# EAGLE design STDAP_V_1_0_0 (EAGLE 7.6.0)
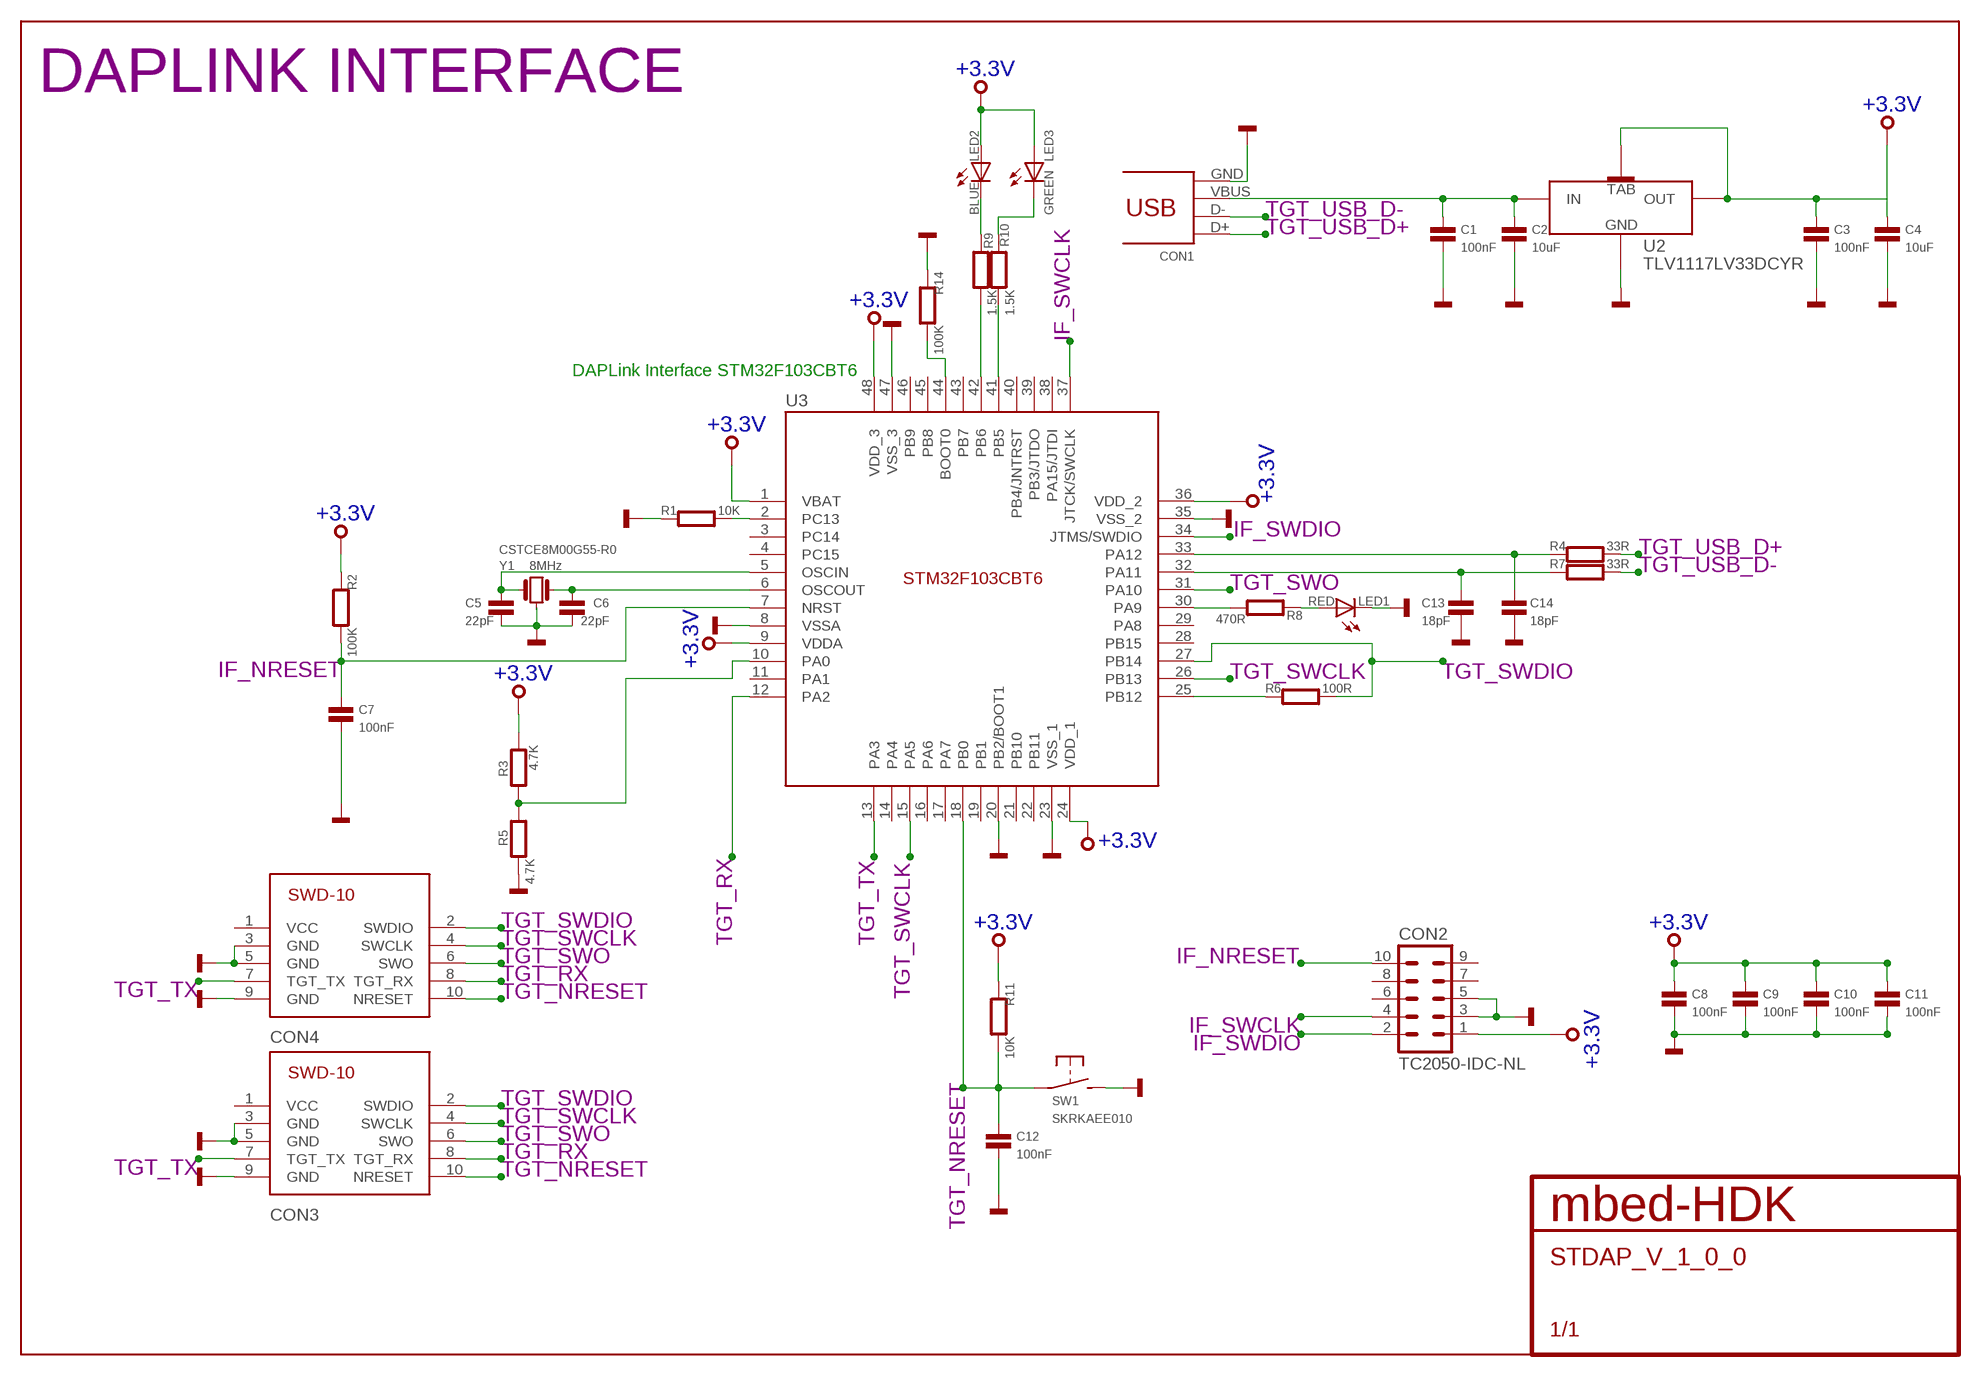
[diagram p0: schematic, sheet 1]

## Parts
C1  100nF  CAPACITOR0402  [0402]
C2  10uF  CAPACITOR0603  [0603]
C3  100nF  CAPACITOR0402  [0402]
C4  10uF  CAPACITOR0603  [0603]
C5  22pF  CAPACITOR0402  [0402]
C6  22pF  CAPACITOR0402  [0402]
C7  100nF  CAPACITOR0402  [0402]
C8  100nF  CAPACITOR0402  [0402]
C9  100nF  CAPACITOR0402  [0402]
C10  100nF  CAPACITOR0402  [0402]
C11  100nF  CAPACITOR0402  [0402]
C12  100nF  CAPACITOR0402  [0402]
C13  18pF  CAPACITOR0402  [0402]
C14  18pF  CAPACITOR0402  [0402]
CON1  47346-0001  [USB-MICRO-B-H]
CON2  TC2050-IDC-NL  [TC2050-IDC-NL]
CON3  3020-10-0200-00  [3020-10-0200-00]
CON4  3220-10-0200-00  [3220-10-0200-00]
LED1  RED  SMD_LED0603  [CHIPLED_0603]
LED2  BLUE  SMD_LED0603  [CHIPLED_0603]
LED3  GREEN  SMD_LED0603  [CHIPLED_0603]
R1  10K  RESISTOR0402  [0402]
R2  100K  RESISTOR0402  [0402]
R3  4.7K  RESISTOR0402  [0402]
R4  33R  RESISTOR0402  [0402]
R5  4.7K  RESISTOR0402  [0402]
R6  100R  RESISTOR0402  [0402]
R7  33R  RESISTOR0402  [0402]
R8  470R  RESISTOR0402  [0402]
R9  1.5K  RESISTOR0402  [0402]
R10  1.5K  RESISTOR0402  [0402]
R11  10K  RESISTOR0402  [0402]
R14  100K  RESISTOR0402  [0402]
SW1  SKRKAEE010  [SKRKAEE010]
U2  TLV1117LV33DCYR  [SOT223]
U3  STM32F103CBT6  [LQFP48]
Y1  CSTCE8M00G55-R0  [CSTCE8M00G55-R0]

## Nets
+3.3V: C3.1 C4.1 C8.1 C9.1 C10.1 C11.1 CON2.1 LED2.A LED3.A R2.1 R3.1 R11.1 U2.OUT(1)(OUT) U2.OUT(2)(TAB) U3.1(VBAT) U3.9(VDDA) U3.24(VDD_1) U3.36(VDD_2) U3.48(VDD_3)
GND: C1.2 C2.2 C3.2 C4.2 C5.2 C6.2 C7.2 C8.2 C9.2 C10.2 C11.2 C12.2 C13.2 C14.2 CON1.GND CON2.3 CON2.5 CON3.3(GND) CON3.5(GND) CON3.9(GND) CON4.3(GND) CON4.5(GND) CON4.9(GND) LED1.C R1.1 R5.2 R14.1 SW1.P$2(S) U2.GND U3.8(VSSA) U3.20(PB2/BOOT1) U3.23(VSS_1) U3.35(VSS_2) U3.47(VSS_3) Y1.2
IF_NRESET: C7.1 CON2.10 R2.2 U3.7(NRST)
IF_SWCLK: CON2.4 U3.37(JTCK/SWCLK)
IF_SWDIO: CON2.2 U3.34(JTMS/SWDIO)
N$1: C1.1 C2.1 CON1.VBUS U2.IN
N$2: R8.2 U3.30(PA9)
N$3: R14.2 U3.44(BOOT0)
N$4: R1.2 U3.2(PC13)
N$5: C6.1 U3.6(OSCOUT) Y1.3
N$6: C5.1 U3.5(OSCIN) Y1.1
N$8: R3.2 R5.1 U3.10(PA0)
N$9: R9.2 U3.42(PB6)
N$10: R10.2 U3.41(PB5)
N$11: LED1.A R8.1
N$12: R6.1 U3.25(PB12)
N$13: LED2.C R9.1
N$14: LED3.C R10.1
N$15: C14.1 R4.1 U3.33(PA12)
N$17: C13.1 R7.1 U3.32(PA11)
TGT_NRESET: C12.1 CON3.10(NRESET) CON4.10(NRESET) R11.2 SW1.P$1(P) U3.18(PB0)
TGT_RX: CON3.8(TGT_RX) CON4.8(TGT_RX) U3.12(PA2)
TGT_SWCLK: CON3.4(SWCLK) CON4.4(SWCLK) U3.15(PA5) U3.26(PB13)
TGT_SWDIO: CON3.2(SWDIO) CON4.2(SWDIO) R6.2 U3.27(PB14)
TGT_SWO: CON3.6(SWO) CON4.6(SWO) U3.31(PA10)
TGT_TX: CON3.7(TGT_TX) CON4.7(TGT_TX) U3.13(PA3)
TGT_USB_D+: CON1.D+ R4.2
TGT_USB_D-: CON1.D- R7.2
Unconnected: CON2.6 CON2.7 CON2.8 CON2.9 CON3.1(VCC) CON4.1(VCC) U3.3(PC14) U3.4(PC15) U3.11(PA1) U3.14(PA4) U3.16(PA6) U3.17(PA7) U3.19(PB1) U3.21(PB10) U3.22(PB11) U3.28(PB15) U3.29(PA8) U3.38(PA15/JTDI) U3.39(PB3/JTDO) U3.40(PB4/JNTRST) U3.43(PB7) U3.45(PB8) U3.46(PB9)

## Notes on the sheet
- DAPLINK INTERFACE
- DAPLink Interface STM32F103CBT6
- 8MHz

## Library data of the parts
C1 C3 C7-C12 = mbed-HDK-RLCQ:CAPACITOR: Capacitor
C2 C4-C6 C13 C14 = mbed-HDK-RLC:CAPACITOR: Capacitor
CON1 = mbed-HDK-Connector:47346-0001: USB Receptacle Horizontal Micro Type B; MF: MOLEX; MFN: 47346-0001; OC-MOUSER: 538-47346-0001; OC-NEWARK: 1568026
CON2 = mbed-HDK-Connector:TC2050-IDC: Tag-Connect In Circuit Programming & Debug Cable 10 Pin
CON3 = mbed-HDK-Connector:3020-10-0200-00: 10 Positions Header Connector 0.100" (2.54mm) Through Hole, Right Angle Gold; MF: CNC Tech; MFN: 3020-10-0200-00; OC-DIGIKEY: 1175-1615-ND
CON4 = mbed-HDK-Connector:3220-10-0200-00: 10 Positions Header Connector 0.050" (1.27mm) Through Hole, Right Angle Gold; MF: CNC Tech; MFN: 3220-10-0200-00; OC-DIGIKEY: 1175-1628-ND
LED1-LED3 = mbed-HDK-Optical:SMD_LED: LED SMD, Colour Red; MF: Wurth Electronics Inc; MFN: 150060RS75000; OC-DIGIKEY: 732-4978-1-ND; OC-MOUSER: 710-150060RS75000; OC-NEWARK: 2322071
R1 R4 R6 R7 = mbed-HDK-RLC:RESISTOR: Resistor
R2 R3 R5 R8-R11 R14 = mbed-HDK-RLCQ:RESISTOR: Resistor
SW1 = mbed-HDK-Switch:SKRKAEE010: MOMENTARY SWITCH PUSH VERTICAL (SPST); MF: ALPS; MFN: SKRKAEE010; OC-MOUSER: 688-SKRKAE
U2 = mbed-HDK-Power:TLV1117LV33DCYR: LDO Fixed Regulator 3.3v, 1A; MF: Texas Instruments; MFN: TLV1117LV33DCYR; OC-DIGIKEY: 296-28778-1-ND; OC-MOUSER: 595-TLV1117LV33DCYR; OC-NEWARK: 2323647
U3 = mbed-HDK-MF-ST:STM32F103CBT6: ARM® Cortex®-M3 STM32 F1 Microcontroller IC 32-Bit 72MHz 128KB (128K x 8) FLASH; MF: STMicroelectronics; MFN: STM32F103CBT6; OC-DIGIKEY: 497-6288-ND; OC-MOUSER: 511-STM32F103CBT6; OC-NEWARK: 11N8296
Y1 = mbed-HDK-Oscillator:CSTCE8M00G55-R0: Resonator Cermanic, Murata 8MHz 33pF; MF: Murata; MFN: CSTCE8M00G55-R0; OC-DIGIKEY: 490-1195-1-ND; OC-MOUSER: 81-CSTCE8M00G55-R0; OC-NEWARK: 2443270

## Board
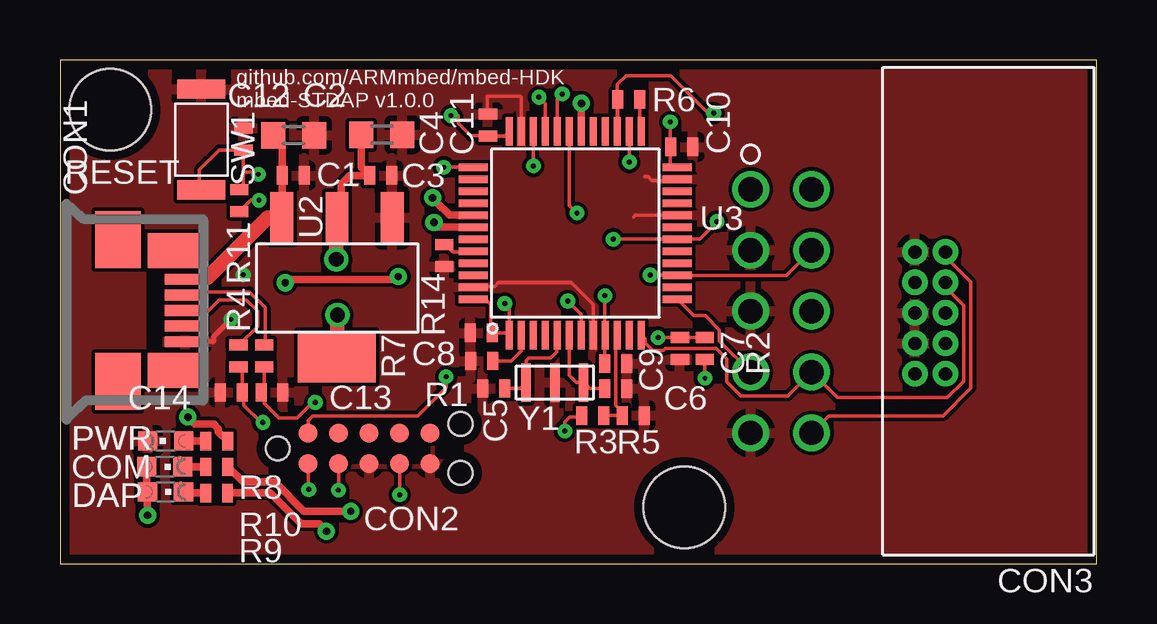
[diagram p1: board, top side]
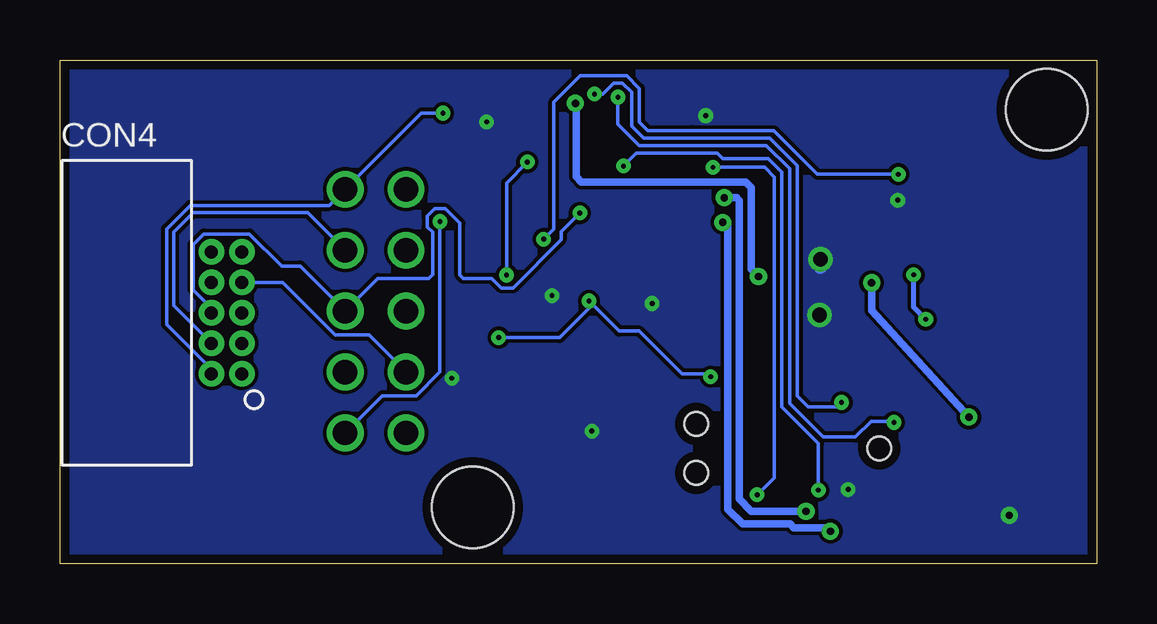
[diagram p2: board, bottom side, seen from below]

Size 43.2 x 21 mm. Coordinates in mm from the lower left corner, seen from the top.
Outline: 0,0 43.2,0 43.2,21 0,21 0,0
Copper layers ((1*16)): Top 0.035mm / dielectric 0.8mm / Bottom 0.035mm
Design rules "mbed-HDK-6-6-2-layer": minimum track width 6mil, minimum drill 9mil, track to track 6mil, track to pad 6mil, pad to pad 6mil, via to via 6mil, smd to smd 6mil, copper to edge 15mil, drill to drill 8mil, minimum pad ring 10mil, minimum via ring 8mil, stop-mask expansion 4mil, vias tented up to drill 0mil, thermal gap 10mil
Holes 3.4 mm at 26.01,2.34 2.1,18.92

### Footprints (pad centres in the part's own frame; a part is rotated, then mirrored left to right if it is on the bottom)
0402 = smd 0.457 x 0.762: 1 -0.457,0; 2 0.457,0
0603 = smd 1 x 1.1: 1 -0.85,0; 2 0.85,0
USB-MICRO-B-H = smd 1.7 x 0.45: 4 2.8,-0.65; D+ 2.8,0; D- 2.8,0.65; GND 2.8,-1.3; VBUS 2.8,1.3 | smd 1.9 x 2.375: GND1 0,2.95; GND4 0,-2.95 | smd 2.1 x 1.475: GND2 2.3,2.5; GND3 2.3,-2.5
TC2050-IDC-NL = smd 0.787 x 0.787: 1 -2.54,-0.635; 2 -1.27,-0.635; 3 0,-0.635; 4 1.27,-0.635; 5 2.54,-0.635; 6 2.54,0.635; 7 1.27,0.635; 8 0,0.635; 9 -1.27,0.635; 10 -2.54,0.635 | hole 0.991: -3.81,0; 3.81,1.016; 3.81,-1.016
3020-10-0200-00 = drill 1.02: 1 10.16,0; 2 10.16,-2.54; 3 7.62,0; 4 7.62,-2.54; 5 5.08,0; 6 5.08,-2.54; 7 2.54,0; 8 2.54,-2.54; 9 0,0; 10 0,-2.54
3220-10-0200-00 = drill 0.55 pad 0.9: 1 5.08,0; 2 5.08,-1.27; 3 3.81,0; 4 3.81,-1.27; 5 2.54,0; 6 2.54,-1.27; 7 1.27,0; 8 1.27,-1.27; 9 0,0; 10 0,-1.27
CHIPLED_0603 = smd 0.8 x 0.8: A 0,-0.75; C 0,0.75
SKRKAEE010 = smd 0.8 x 2: P$1 -2.1,0; P$2 2.1,0
SOT223 = smd 0.95 x 2.15: GND -2.3,-5.8; IN 2.3,-5.8; OUT(1) 0,-5.8 | smd 3.25 x 2.15: OUT(2) 0,0
LQFP48 = smd 0.3 x 1.2: 1 0,0; 2 0.5,0; 3 1,0; 4 1.5,0; 5 2,0; 6 2.5,0; 7 3,0; 8 3.5,0; 9 4,0; 10 4.5,0; 11 5,0; 12 5.5,0; 25 5.5,8.5; 26 5,8.5; 27 4.5,8.5; 28 4,8.5; 29 3.5,8.5; 30 3,8.5; 31 2.5,8.5; 32 2,8.5; 33 1.5,8.5; 34 1,8.5; 35 0.5,8.5; 36 0,8.5 | smd 1.2 x 0.3: 13 7,1.5; 14 7,2; 15 7,2.5; 16 7,3; 17 7,3.5; 18 7,4; 19 7,4.5; 20 7,5; 21 7,5.5; 22 7,6; 23 7,6.5; 24 7,7; 37 -1.5,7; 38 -1.5,6.5; 39 -1.5,6; 40 -1.5,5.5; 41 -1.5,5; 42 -1.5,4.5; 43 -1.5,4; 44 -1.5,3.5; 45 -1.5,3; 46 -1.5,2.5; 47 -1.5,2; 48 -1.5,1.5
CSTCE8M00G55-R0 = smd 0.4 x 1.6: 1 2.4,0; 2 1.2,0; 3 0,0

### Placement (x,y rotation side)
C1  9.72,16.19 0 top
C2  9.73,17.86 0 top
C3  13.37,16.19 0 top
C4  13.41,17.88 0 top
C5  18.07,7.3 180 top
C6  23.16,7.3 0 top
C7  25.83,8.97 270 top
C8  17.55,9.62 180 top
C9  23.16,8.34 0 top
C10  25.91,17.37 0 top
C11  17.83,18.29 90 top
C12  7.65,17.7 90 top
C13  8.83,7.14 0 top
C14  7.14,7.14 180 top
CON1  2.41,10.55 0 top
CON2  12.88,4.8 0 top
CON3  28.78,5.45 90 top
CON4  35.62,12.99 270 bottom
LED1  4.4,5.11 90 top
LED2  4.39,2.98 270 top
LED3  4.37,4.04 270 top
R1  17.57,8.45 0 top
R2  26.87,8.97 90 top
R3  22.2,6.17 0 top
R4  7.44,8.66 90 top
R5  23.88,6.17 0 top
R6  23.7,19.35 180 top
R7  8.51,8.66 90 top
R8  6.53,5.11 0 top
R9  6.52,2.94 0 top
R10  6.53,4.03 0 top
R11  7.47,15.14 90 top
R14  16.01,12.85 90 top
SW1  5.89,17.68 90 top
U2  11.54,8.62 180 top
U3  18.72,9.53 0 top
Y1  21.82,7.54 180 top

### Tracks (layer width: path | path; a pad name or v marks a point on that pad's centre or on a via)
+3.3V  (via drill 0.2, 0.3, 0.61)
  Top 0.152: U3.9 22.7,9.51 C9.1 v22.7,11.17 | R3.1 21.68,6.11 21.24,6.11 21.04,5.91 v21.04,5.52 | U3.24 25.49,16.52 25.43,16.59 25.43,17.35 | 25.43,17.35 C10.1 | 25.43,17.35 v25.43,18.41 | U3.36 18.54,17.83 C11.1 17.82,17.84 17.11,17.84 16.59,18.37 16.59,18.68 v16.29,18.68 | U3.48 17.73,11.03 17.96,10.79 17.96,9.67 C8.1 18.62,9.62 U3.1 18.72,10.65 v18.53,10.85 | CON2.1 10.34,3.11 v10.36,3.09 | R2.1 v26.87,7.73 | R11.1 7.94,15.15 v8.29,15.15
  Top 0.305: C4.1 12.56,16.54 C3.1 12.07,16.19 11.71,15.82 11.71,14.58 11.56,14.42 | LED3.A 3.62,3.01 LED2.A 3.64,2.11 v3.65,2.01
  Top 0.61: U2.OUT(2) 11.56,8.62 v11.56,10.36 | 11.56,14.42 U2.OUT(1) v11.51,12.68
  Bottom 0.152: v21.04,5.52 21.02,5.5 21.02,5.38 | v25.43,18.41 25.41,18.41 25.38,18.45 | v18.53,10.85 18.51,10.85 18.49,10.83 | v22.7,11.17 22.7,10.9 22.75,10.95 | v10.36,3.09 10.36,3.02 10.38,3 | v26.87,7.73 26.87,7.68 26.94,7.61 | v16.29,18.68 16.17,18.49 | v8.29,15.15 8.27,15.21 8.27,15.33
  Bottom 0.305: v3.65,2.01 3.65,1.87 3.63,1.86
  Bottom 0.61: 11.51,12.38 11.51,12.58 11.5,12.58
  pour Bottom: -2.82,-2.08 44.36,-1.92 44.65,22.36 -1.99,22.47
GND  (via drill 0.2)
  Top 0.152: U3.8 22.22,10.8 21.31,11.71 18.26,11.71 18.11,11.56 17.25,11.56 U3.47 | U3.20 23.97,14.53 23.9,14.45 | 24.36,16.13 24.51,16.13 24.66,15.98 25.67,15.98 U3.23 | U3.35 19.22,19.44 19.18,19.48 17.8,19.48 17.8,18.77 C11.2
  Top 0.203: v7.12,10.19 6.4,9.46 6.4,9.27 6.38,9.25 CON1.GND
  Bottom 0.203: v7.12,10.19 7.63,10.69 v7.63,12.04
  pour Top: -2.84,22.4 -2.62,-2.01 44.63,-1.74 44.4,22.67
IF_NRESET  (via drill 0.2)
  Top 0.152: U3.7 21.72,10.39 v21.16,10.95 | v24.92,9.42 C7.1 R2.2 | CON2.10 10.34,5.97 10.52,6.15 13.85,6.15 13.86,6.15 14.9,6.15 16.09,7.33 v16.09,7.79
  Bottom 0.152: v24.92,9.42 22.38,9.42 21.01,10.79 21.01,11.1 v21.16,10.95 19.91,9.7 19.06,9.7 17.27,7.92 16.21,7.92 v16.09,7.79
IF_SWCLK  (via drill 0.2)
  Top 0.152: U3.37 v15.99,16.52 | v14.15,2.87 CON2.4
  Bottom 0.152: v15.99,16.52 13.84,16.52 13.44,16.12 13.44,3.58 v14.15,2.87
IF_SWDIO  (via drill 0.2)
  Top 0.152: CON2.2 v11.61,3.07 v11.6,3.06 | v19.72,16.58 U3.34
  Bottom 0.152: v11.6,3.06 11.6,5.01 13.12,6.53 13.12,16.32 13.69,16.89 15.59,16.89 15.82,17.12 19.18,17.12 v19.72,16.58
N$1
  Top 0.203: 6.16,11.93 5.29,11.93 CON1.VBUS
  Top 0.305: U2.IN 9.26,14.42 C1.1 9.26,17.48 arc90 C2.1
  Top 0.61: 6.16,11.93 8.66,14.42 U2.IN
N$2  (via drill 0.3)
  Top 0.305: U3.30 v21.72,19.19 | v9.38,11.71 9.53,11.85 13.98,11.85 v14.1,11.97 | v5.33,6.11 5.62,5.82 6.4,5.82 6.6,5.61 6.6,5.49 R8.2
  Bottom 0.305: v21.72,19.19 21.7,19.16 21.7,16.13 21.48,15.91 14.64,15.91 14.4,15.68 14.4,12.28 v14.1,11.97 | v9.38,11.71 9.38,10.55 v5.33,6.11
N$3
  Top 0.152: R14.2 16.06,13.31 16.37,13 17.19,13 U3.44
N$4
  Top 0.152: R1.2 18.8,8.45 19.22,8.87 U3.2
N$5
  Top 0.152: U3.6 21.21,9.51 21.21,7.84 21.5,7.54 Y1.3 22.07,7.3 C6.1
N$6
  Top 0.152: U3.5 20.7,9.51 20.7,8.82 20.45,8.57 19.53,8.57 19.42,8.46 Y1.1 19.18,7.3 C5.1
N$8
  Top 0.152: U3.10 23.16,9.46 23.16,6.58 23.43,6.31 R5.1 R3.2
N$9  (via drill 0.3)
  Top 0.305: U3.42 15.78,14.03 v15.58,14.22 | 7,2.92 R9.2 8.76,2.94 10.05,1.65 | v11.1,1.35 10.79,1.65 10.05,1.65 | 10.05,1.65 10.03,1.65
  Bottom 0.305: v15.58,14.22 15.51,14.22 15.37,14.09 15.37,2.27 14.76,1.65 12.78,1.65 12.62,1.5 11.25,1.5 v11.1,1.35
N$10  (via drill 0.3)
  Top 0.305: U3.41 16.23,14.53 15.66,15.1 15.66,15.12 v15.53,15.25 | v12.12,2.18 v12.11,2.18 10.16,2.18 8.95,3.4 7.63,3.4 R10.2
  Bottom 0.305: v15.53,15.25 15.01,15.25 14.9,15.14 14.9,2.69 14.39,2.18 v12.12,2.18
N$11
  Top 0.305: LED1.A R8.1
N$12
  Top 0.152: U3.25 arc-90 24.16,18.09 R6.1
N$13
  Top 0.305: LED2.C 5.19,2.94 R9.1
N$14
  Top 0.305: LED3.C R10.1
N$15  (via drill 0.2)
  Top 0.152: R4.1 7.59,8.05 C14.1 7.66,7.07 7.66,6.6 8.38,5.89 v8.45,5.89 | U3.33 20.22,19.18 v19.95,19.45
  Bottom 0.152: v19.95,19.45 19.95,18.31 19.07,17.43 13.77,17.43 12.8,16.46 12.8,6.68 11.4,5.28 10.06,5.28 9.4,5.93 8.5,5.93 v8.45,5.89
N$17  (via drill 0.2)
  Top 0.152: U3.32 20.72,19.37 v20.93,19.58 | v10.64,6.72 10.49,6.68 9.88,6.07 9.12,6.07 8.51,6.68 8.51,7 C13.1 8.51,7.27 R7.1
  Bottom 0.152: v20.93,19.58 20.59,19.58 20.14,20.03 19.77,20.03 19.39,19.65 19.39,18.25 18.88,17.74 13.63,17.74 12.47,16.59 12.47,6.99 12.01,6.53 10.79,6.53 v10.64,6.72
TGT_NRESET  (via drill 0.2)
  Top 0.152: R11.2 7.64,15.77 7.64,16.32 | 7.64,16.32 C12.1 6.63,17.25 5.8,16.42 5.8,15.67 SW1.P$1 | v23.05,13.53 U3.18 26.66,13.53 26.66,13.54 27.38,14.26 v27.37,14.26 | v8.27,16.23 8.18,16.32 7.64,16.32 | CON4.10 36.89,12.79 37.96,11.73 37.96,7.32 36.79,6.16 32.03,6.16 CON3.10
  Bottom 0.152: v23.05,13.53 22.62,13.95 22.62,19.24 21.52,20.34 19.59,20.34 19.06,19.81 19.06,18.41 18.7,18.05 16.84,18.05 16.83,18.05 13.46,18.05 11.64,16.23 v8.27,16.23 | CON3.10 29.77,7 28.37,7 27.37,7.99 v27.37,14.26
TGT_RX
  Top 0.152: U3.12 24.39,9.35 24.39,9.2 24.7,8.89 25.14,8.89 25.22,8.97 27.34,8.97 27.79,8.52 27.79,7.58 28.37,7 30.32,7 CON3.8 32.38,6.92 36.97,6.92 37.65,7.6 37.65,10.77 36.89,11.52 CON4.8
TGT_SWCLK  (via drill 0.2)
  Top 0.152: v23.72,16.75 U3.26 | v24.59,12.03 24.61,12.01 24.66,12.01 24.67,12.03 U3.15 25.73,12.01 30.26,12.01 CON3.4
  Bottom 0.152: v24.59,12.03 24.59,15.88 v23.72,16.75 | CON4.4 36.89,9.21 38.46,10.77 38.46,13.83 37.66,14.63 32.88,14.63 CON3.4
TGT_SWDIO  (via drill 0.2)
  Top 0.152: R6.2 23.24,18.05 arc-90 U3.27 23.22,19.98 23.58,20.34 25.44,20.34 26.96,18.82 27.2,18.82 v27.24,18.78
  Bottom 0.152: v27.24,18.78 28.14,18.78 31.27,15.66 | 31.27,15.66 CON3.2 | CON4.2 36.89,8.11 38.76,9.98 38.76,13.96 37.78,14.94 31.99,14.94 31.27,15.66
TGT_SWO  (via drill 0.2)
  Top 0.152: U3.31 21.22,14.94 v21.54,14.62
  Bottom 0.152: v21.54,14.62 22.32,13.84 22.32,13.5 24.32,11.5 24.81,11.5 25.2,11.89 26.4,11.89 26.54,12.03 26.54,14.19 27.15,14.8 27.59,14.8 27.9,14.48 27.9,14.04 27.67,13.81 27.67,12.05 27.84,11.89 29.96,11.89 CON3.6 33.2,12.41 33.97,12.41 35.31,13.75 37.21,13.75 37.65,13.31 37.65,11.41 36.89,10.65 CON4.6
TGT_TX
  Top 0.152: U3.13 26.41,10.34 26.89,10.34 27.48,9.75 27.48,9.29 CON3.7
  Bottom 0.152: CON3.7 30.32,9.54 31.73,9.54 33.92,11.72 CON4.7
TGT_USB_D+
  Top 0.152: R4.2 7.46,9.12 8.23,9.89 8.23,10.53 7.76,11 6.63,11 6.17,10.54 5.22,10.54 CON1.D+
TGT_USB_D-
  Top 0.152: CON1.D- 5.21,11.33 7.89,11.33 8.55,10.67 8.55,9.16 R7.2

### Text on the board
tPlace: github.com/ARMmbed/mbed-HDK / mbed-STDAP v1.0.0 | RESET | PWR | PWR | COM | DAP | DAP